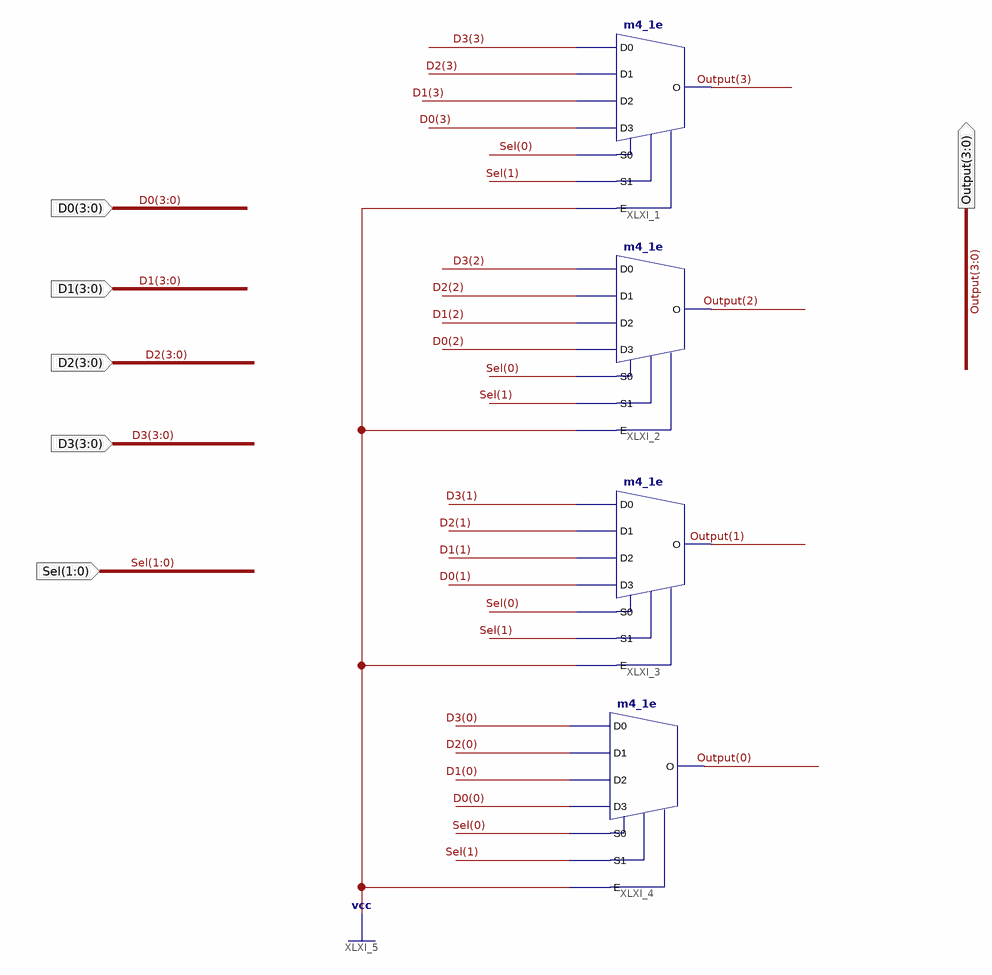
[diagram p0: schematic sheet 1]
// Xilinx ISE schematic Mux4_1_4.sch (spartan6) as structural Verilog: 4 symbols, 6 ports
module Mux4_1_4 (
  input  [3:0] D0,
  input  [3:0] D1,
  input  [3:0] D2,
  input  [3:0] D3,
  input  [1:0] Sel,
  output [3:0] Output
);

  m4_1e XLXI_1 (.D0(D3[3]), .D1(D2[3]), .D2(D1[3]), .D3(D0[3]), .E(1'b1), .S0(Sel[0]), .S1(Sel[1]), .O(Output[3]));
  m4_1e XLXI_2 (.D0(D3[2]), .D1(D2[2]), .D2(D1[2]), .D3(D0[2]), .E(1'b1), .S0(Sel[0]), .S1(Sel[1]), .O(Output[2]));
  m4_1e XLXI_3 (.D0(D3[1]), .D1(D2[1]), .D2(D1[1]), .D3(D0[1]), .E(1'b1), .S0(Sel[0]), .S1(Sel[1]), .O(Output[1]));
  m4_1e XLXI_4 (.D0(D3[0]), .D1(D2[0]), .D2(D1[0]), .D3(D0[0]), .E(1'b1), .S0(Sel[0]), .S1(Sel[1]), .O(Output[0]));
endmodule
